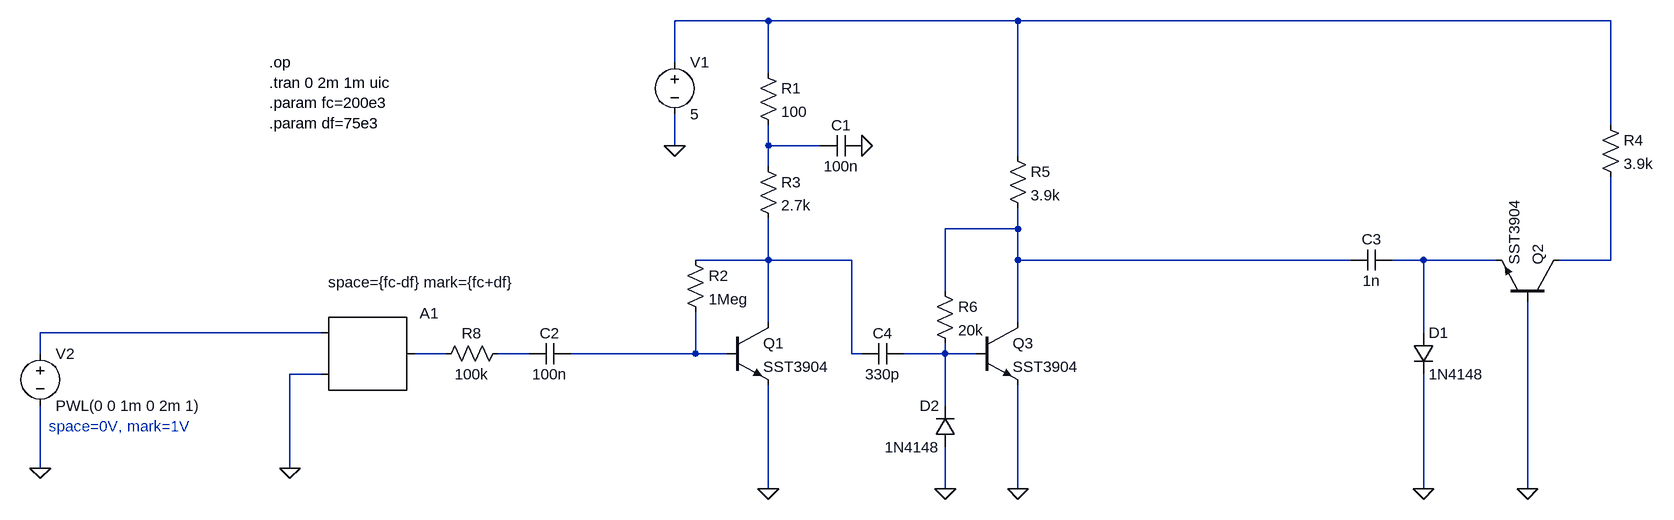
[diagram p0: schematic cool386.asc]
cool386.asc, the LTspice schematic file:
Version 4
SHEET 1 2044 1288
WIRE -304 -144 -448 -144
WIRE 80 -144 -304 -144
WIRE 992 -144 80 -144
WIRE -448 -80 -448 -144
WIRE -304 -64 -304 -144
WIRE 992 16 992 -144
WIRE -448 48 -448 0
WIRE -304 48 -304 16
WIRE -224 48 -304 48
WIRE 80 64 80 -144
WIRE -304 80 -304 48
WIRE 80 176 80 144
WIRE 80 176 -32 176
WIRE -304 224 -304 160
WIRE -304 224 -416 224
WIRE -176 224 -304 224
WIRE 80 224 80 176
WIRE 592 224 80 224
WIRE 704 224 656 224
WIRE 816 224 704 224
WIRE 992 224 992 96
WIRE 992 224 912 224
WIRE -32 272 -32 176
WIRE -304 320 -304 224
WIRE 80 320 80 224
WIRE -992 336 -1424 336
WIRE 704 336 704 224
WIRE -1424 368 -1424 336
WIRE -800 368 -848 368
WIRE -672 368 -720 368
WIRE -416 368 -416 304
WIRE -416 368 -608 368
WIRE -368 368 -416 368
WIRE -176 368 -176 224
WIRE -160 368 -176 368
WIRE -32 368 -32 352
WIRE -32 368 -96 368
WIRE 16 368 -32 368
WIRE -992 400 -1040 400
WIRE -32 448 -32 368
WIRE -1424 544 -1424 448
WIRE -1040 544 -1040 400
WIRE -304 576 -304 416
WIRE -32 576 -32 512
WIRE 80 576 80 416
WIRE 704 576 704 400
WIRE 864 576 864 288
FLAG -304 576 0
FLAG -160 48 0
FLAG -448 48 0
FLAG -1040 544 0
FLAG -1424 544 0
FLAG 704 576 0
FLAG 864 576 0
FLAG -32 576 0
FLAG 80 576 0
DATAFLAG -512 368 ""
DATAFLAG -256 224 ""
SYMBOL npn -368 320 R0
SYMATTR InstName Q1
SYMATTR Value SST3904
SYMBOL res -320 -80 R0
SYMATTR InstName R1
SYMATTR Value 100
SYMBOL cap -160 32 R90
WINDOW 0 0 32 VBottom 2
WINDOW 3 32 32 VTop 2
SYMATTR InstName C1
SYMATTR Value 100n
SYMBOL res -432 208 R0
SYMATTR InstName R2
SYMATTR Value 1Meg
SYMBOL res -320 64 R0
SYMATTR InstName R3
SYMATTR Value 2.7k
SYMBOL voltage -448 -96 R0
WINDOW 123 0 0 Left 0
WINDOW 39 0 0 Left 0
SYMATTR InstName V1
SYMATTR Value 5
SYMBOL cap -608 352 R90
WINDOW 0 0 32 VBottom 2
WINDOW 3 32 32 VTop 2
SYMATTR InstName C2
SYMATTR Value 100n
SYMBOL npn 912 288 M270
SYMATTR InstName Q2
SYMATTR Value SST3904
SYMBOL res 976 0 R0
SYMATTR InstName R4
SYMATTR Value 3.9k
SYMBOL cap 656 208 R90
WINDOW 0 0 32 VBottom 2
WINDOW 3 32 32 VTop 2
SYMATTR InstName C3
SYMATTR Value 1n
SYMBOL diode 688 336 R0
SYMATTR InstName D1
SYMATTR Value 1N4148
SYMBOL SpecialFunctions\\modulate -992 336 R0
WINDOW 3 11 -78 Left 2
SYMATTR Value space={fc-df} mark={fc+df}
SYMATTR InstName A1
SYMBOL res -704 352 R90
WINDOW 0 0 56 VBottom 2
WINDOW 3 32 56 VTop 2
SYMATTR InstName R8
SYMATTR Value 100k
SYMBOL voltage -1424 352 R0
WINDOW 123 0 0 Left 0
WINDOW 39 0 0 Left 0
SYMATTR InstName V2
SYMATTR Value PWL(0 0 1m 0 2m 1)
SYMBOL npn 16 320 R0
SYMATTR InstName Q3
SYMATTR Value SST3904
SYMBOL res 64 48 R0
SYMATTR InstName R5
SYMATTR Value 3.9k
SYMBOL diode -16 512 R180
WINDOW 0 24 64 Left 2
WINDOW 3 24 0 Left 2
SYMATTR InstName D2
SYMATTR Value 1N4148
SYMBOL res -48 256 R0
SYMATTR InstName R6
SYMATTR Value 20k
SYMBOL cap -96 352 R90
WINDOW 0 0 32 VBottom 2
WINDOW 3 32 32 VTop 2
SYMATTR InstName C4
SYMATTR Value 330p
TEXT -1072 -80 Left 2 !.op\n.tran 0 2m 1m uic\n.param fc=200e3\n.param df=75e3
TEXT -1192 480 Right 2 ;space=0V, mark=1V

The netlist it stands for:
* cool386.asc
Q1 N004 N010 0 0 SST3904
R1 N001 N002 100
C1 0 N002 100n
R2 N004 N010 1Meg
R3 N002 N004 2.7k
V1 N001 0 5
C2 N010 N009 100n
Q2 N006 0 N005 0 SST3904
R4 N001 N006 3.9k
C3 N005 N003 1n
D1 N005 0 1N4148
A1 N007 0 0 0 0 0 N008 0 MODULATOR space={fc-df} mark={fc+df}
R8 N009 N008 100k
V2 N007 0 PWL(0 0 1m 0 2m 1)
Q3 N003 N011 0 0 SST3904
R5 N001 N003 3.9k
D2 0 N011 1N4148
R6 N003 N011 20k
C4 N011 N004 330p
.model D D
.lib standard.dio
.model NPN NPN
.model PNP PNP
.lib standard.bjt
.op
.tran 0 2m 1m uic
.param fc=200e3
.param df=75e3
* space=0V, mark=1V
.backanno
.end